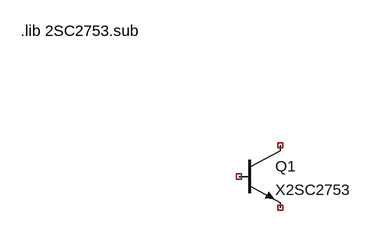
[diagram p0: schematic setup.asc]
setup.asc, the LTspice schematic file:
Version 4
SHEET 1 916 680
SYMBOL npn -608 -464 R0
SYMATTR InstName Q1
SYMATTR Value X2SC2753
SYMATTR Prefix X1
TEXT -944 -640 Left 2 !.lib 2SC2753.sub

The netlist it stands for:
* setup.asc
XQ1 NC_01 NC_02 NC_03 X2SC2753  ; pins C B E
.lib 2SC2753.sub
.backanno
.end